# EasyEDA schematic SCH_RPdrums_2024-07-31.json
TITLE: Sheet_1; REV: 1.0; Date: 2024-07-27; Sheet: 1/1; Drawn By: cashimor; Company: Your Company
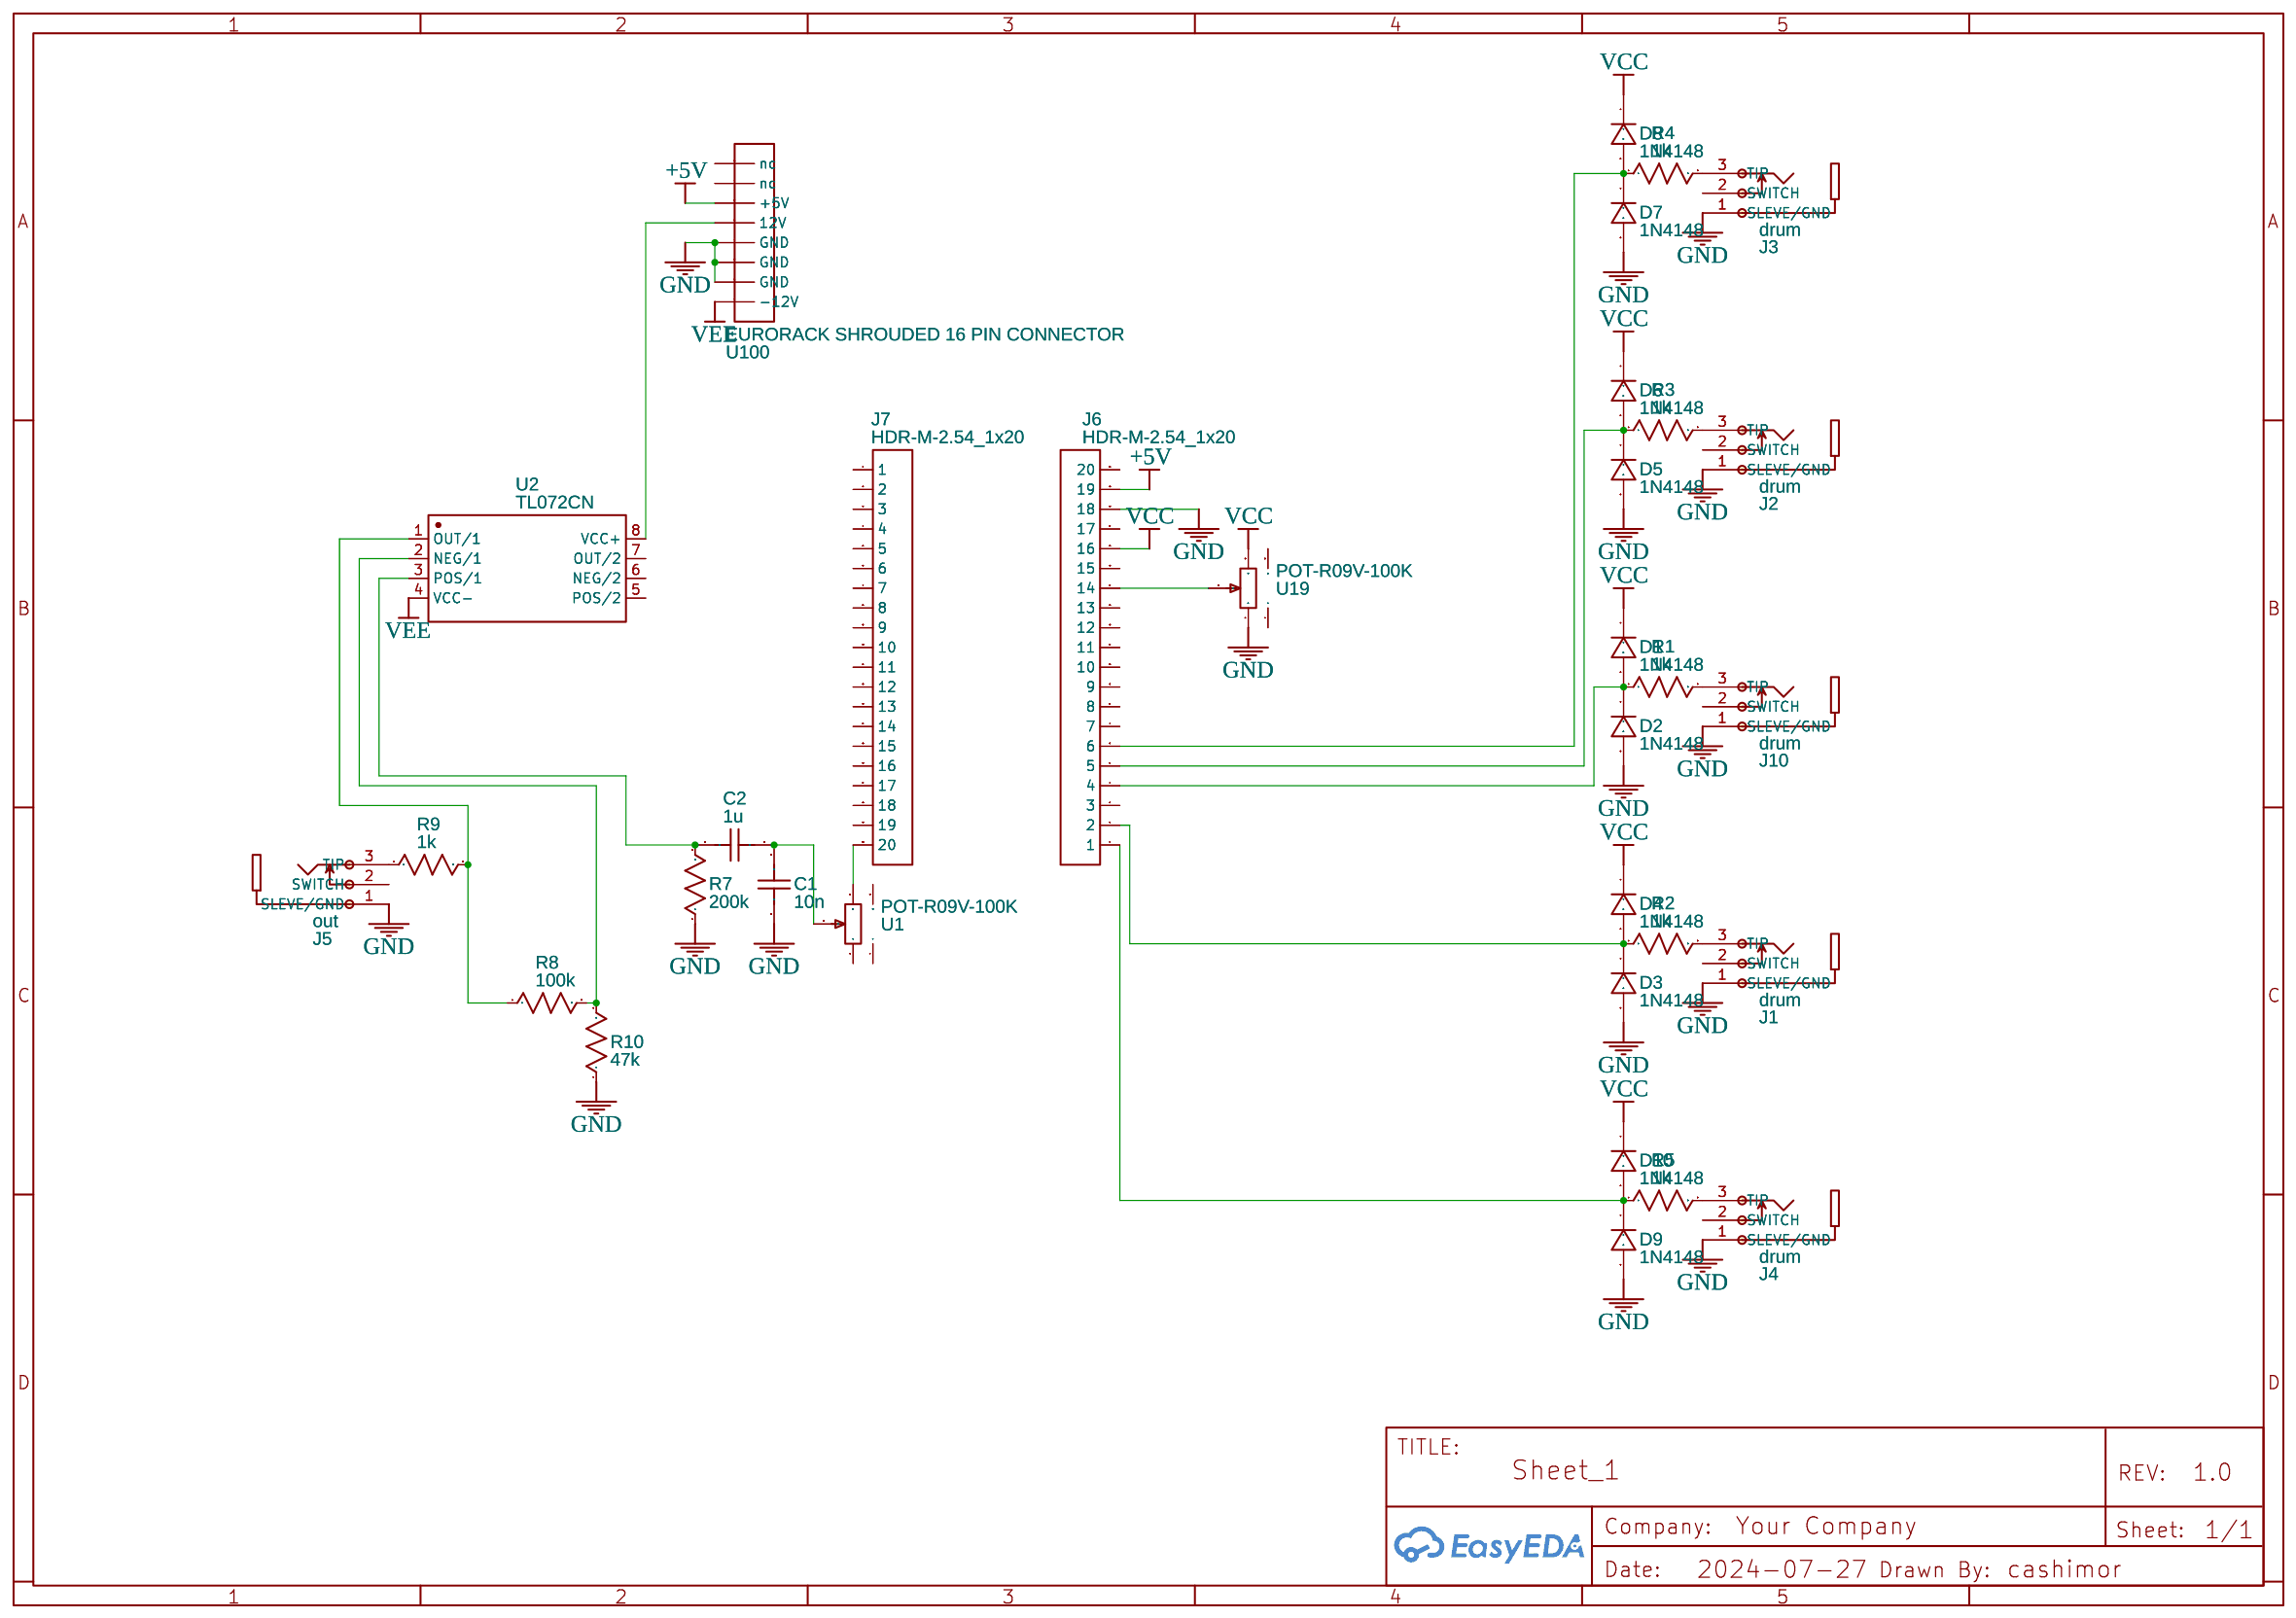
[diagram p0: schematic sheet]

## Parts
C1  10n  [RAD-0.1]
C2  1u  [RAD-0.1]
D1  1N4148  [DO-35_BD2.0-L4.2-P8.20-D0.5-RD]
D2  1N4148  [DO-35_BD2.0-L4.2-P8.20-D0.5-RD]
D3  1N4148  [DO-35_BD2.0-L4.2-P8.20-D0.5-RD]
D4  1N4148  [DO-35_BD2.0-L4.2-P8.20-D0.5-RD]
D5  1N4148  [DO-35_BD2.0-L4.2-P8.20-D0.5-RD]
D6  1N4148  [DO-35_BD2.0-L4.2-P8.20-D0.5-RD]
D7  1N4148  [DO-35_BD2.0-L4.2-P8.20-D0.5-RD]
D8  1N4148  [DO-35_BD2.0-L4.2-P8.20-D0.5-RD]
D9  1N4148  [DO-35_BD2.0-L4.2-P8.20-D0.5-RD]
D10  1N4148  [DO-35_BD2.0-L4.2-P8.20-D0.5-RD]
J1  drum  [THONKICONN_1]
J2  drum  [THONKICONN_1]
J3  drum  [THONKICONN_1]
J4  drum  [THONKICONN_1]
J5  out  [THONKICONN_1]
J6  HDR-M-2.54_1x20  [HDR-M-2.54_1X20]
J7  HDR-M-2.54_1x20  [HDR-M-2.54_1X20]
J10  drum  [THONKICONN_1]
R1  1k  [R_AXIAL-0.3]
R2  1k  [R_AXIAL-0.3]
R3  1k  [R_AXIAL-0.3]
R4  1k  [R_AXIAL-0.3]
R5  1k  [R_AXIAL-0.3]
R7  200k  [R_AXIAL-0.3]
R8  100k  [R_AXIAL-0.3]
R9  1k  [R_AXIAL-0.3]
R10  47k  [R_AXIAL-0.3]
U1  POT-R09V-100K  [RES-ADJ-TH_POT-R09V-100K]
U2  TL072CN  [DIP-8_L9.4-W6.4-P2.54-LS9.1-BL]
U19  POT-R09V-100K  [RES-ADJ-TH_POT-R09V-100K]
U100  EURORACK SHROUDED 16 PIN CONNECTOR  [EURORACK SHROUDED POWER 16 PIN]

## Library data of the parts
C1 C2 = C_RAD-0.1_US: Contributor: LCEDA_Lib
D1-D10 = 1N4148: Supplier: LCSC; Supplier Part: C13769; Manufacturer: STMicroelectronics; Contributor: LCSC
J1-J5 J10 = THONKICONN_1: Manufacturer Part: Thonk; Contributor: ashimoke
J6 J7 = HDR-M-2.54_1x20: Supplier Part: C50981; Supplier: LCSC; Contributor: LCEDA_Lib
R1-R5 R7-R10 = R_AXIAL-0.3_US: Contributor: LCEDA_Lib
U1 U19 = POT-R09V-100K: Contributor: lcsc; Supplier: LCSC; Supplier Part: C9900018037; Manufacturer: null; JLCPCB Part Class: Extended Part; link: https://lcsc.com/eda_search?q=C9900018037&%26type=1&ref=editor
U2 = TL072CN: Supplier: LCSC; Manufacturer: STMicroelectronics; Supplier Part: C5164
U100 = EURORACK SHROUDED 16 PIN CONNECTOR: Manufacturer Part: New SchematicLib; Contributor: eduard.frentescu

## Nets
+5V: J6.19 U100.6(+5V)
GND: C1.1 D2.2 D3.2 D5.2 D7.2 D9.2 J1.1(SLEVE/GND) J2.1(SLEVE/GND) J3.1(SLEVE/GND) J4.1(SLEVE/GND) J5.1(SLEVE/GND) J6.18 J10.1(SLEVE/GND) R7.1 R10.1 U19.1 U100.2(GND) U100.3(GND) U100.4(GND)
VCC: D1.1 D4.1 D6.1 D8.1 D10.1 J6.16 U19.3
VEE: U2.4(VCC-) U100.1(-12V)
Net-(C1-2): C1.2 C2.2 U1.2
Net-(C2-1): C2.1 R7.2 U2.3(POS/1)
Net-(D1-2): D1.2 D2.1 J6.4 R1.1
Net-(D3-1): D3.1 D4.2 J6.2 R2.1
Net-(D5-1): D5.1 D6.2 J6.5 R3.1
Net-(D7-1): D7.1 D8.2 J6.6 R4.1
Net-(D9-1): D9.1 D10.2 J6.1 R5.1
Net-(J1-3): J1.3(TIP) R2.2
Net-(J2-3): J2.3(TIP) R3.2
Net-(J3-3): J3.3(TIP) R4.2
Net-(J4-3): J4.3(TIP) R5.2
Net-(J5-3): J5.3(TIP) R9.1
Net-(J6-14): J6.14 U19.2
Net-(J7-20): J7.20 U1.3
Net-(J10-3): J10.3(TIP) R1.2
Net-(R8-1): R8.1 R9.2 U2.1(OUT/1)
Net-(R8-2): R8.2 R10.2 U2.2(NEG/1)
Net-(U2-8): U2.8(VCC+) U100.5(12V)

Not connected (* = marked no-connect by the designer): J1 2(SWITCH); J2 2(SWITCH); J3 2(SWITCH); J4 2(SWITCH); J5 2(SWITCH); J6 3 7 8 9 10 11 12 13 15 17 20; J7 1 2 3 4 5 6 7 8 9 10 11 12 13 14 15 16 17 18 19; J10 2(SWITCH); U1 1 4 5; U2 5(POS/2) 6(NEG/2) 7(OUT/2); U19 4 5; U100 7(nc) 8(nc)
